# Altium schematic sheet LAUNCHXL-F28069_B_1400922_3.SchDoc: LAUNCHXL-F28069_B_1400922
size 301 x 234 mm; Origin: Eagle; Date: 2023/6/4 16:46:29; SheetNumber: 4; GateName_1: G$1; SymbolName_1: FRAME_A_L; LibraryName: frames; DeviceSetName: FRAME_A_L; GateName_2: G$2; SymbolName_2: DOCFIELD; Sheet: Sheet:; REV: REV:; COMPANY: COMPANY:; Scale:1/1: Scale: 1/1; Drawn: Drawn; Checked: Checked; Approved: Approved; Embest: Embest
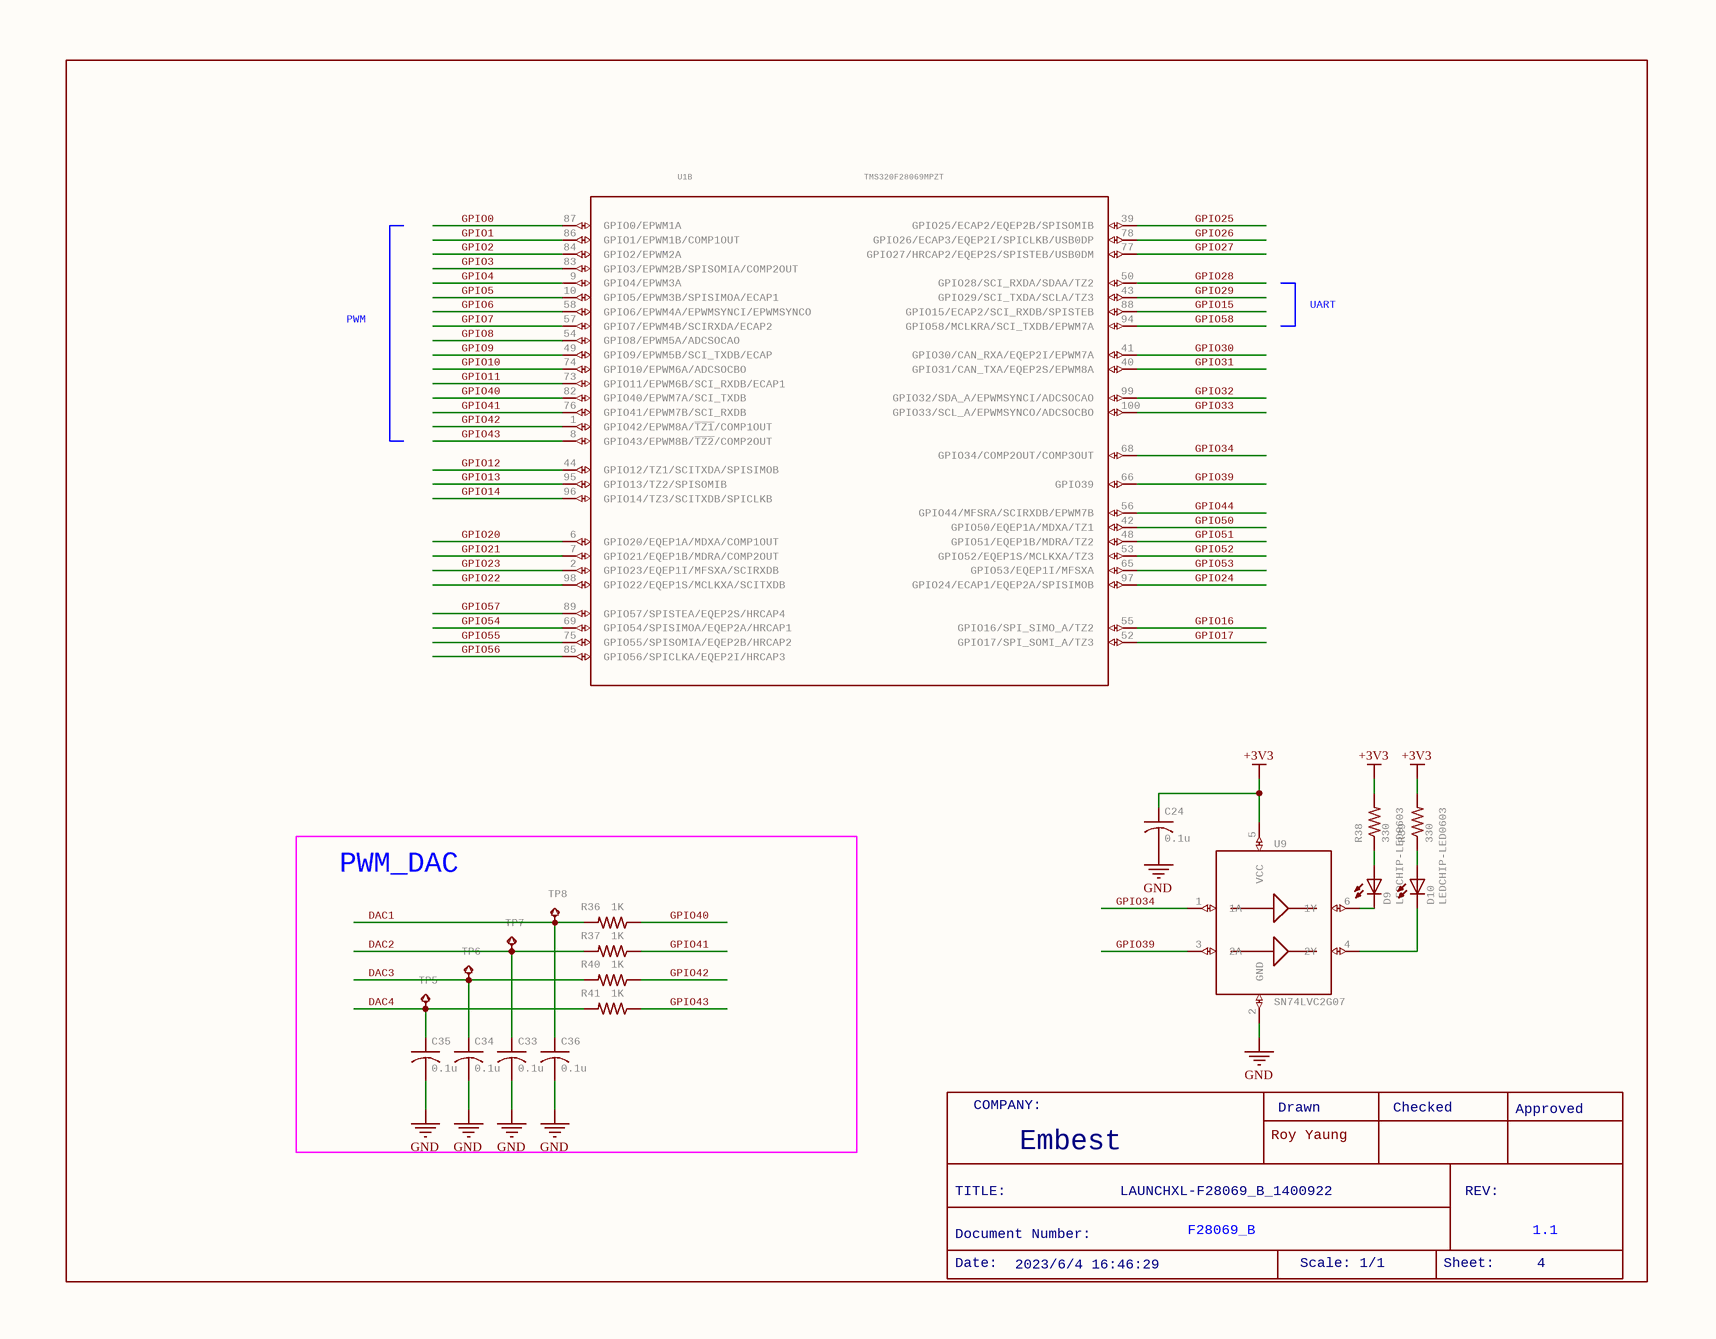
[diagram p0: LAUNCHXL-F28069_B_1400922_3.SchDoc]

## Parts
C24  0.1u  [C0402]
C33  0.1u  [C0402]
C34  0.1u  [C0402]
C35  0.1u  [C0402]
C36  0.1u  [C0402]
D9  LEDCHIP-LED0603  [CHIP-LED0603]
D10  LEDCHIP-LED0603  [CHIP-LED0603]
R36  1K  [R0402]
R37  1K  [R0402]
R38  330  [R0402]
R39  330  [R0402]
R40  1K  [R0402]
R41  1K  [R0402]
TP5  TESTPAD_TPB1,27  [TESTPAD_B1,27]  (value not drawn)
TP6  TESTPAD_TPB1,27  [TESTPAD_B1,27]  (value not drawn)
TP7  TESTPAD_TPB1,27  [TESTPAD_B1,27]  (value not drawn)
TP8  TESTPAD_TPB1,27  [TESTPAD_B1,27]  (value not drawn)
U1  TMS320F28069MPZT  [PQFP100]  (part B of 3)
U9  SN74LVC2G07  [SOT23-6-DBV]

## Blocks framed on the sheet
PWM_DAC: C33-C36 R36 R37 R40 R41 TP5-TP8

## Nets
+3V3: C24.1 R38.2 R39.2 U9.5(VCC)
GND: C24.2 C33.2 C34.2 C35.2 C36.2 U9.2(GND)
DAC1: C36.1 R36.2 TP8.TP
DAC2: C33.1 R37.2 TP7.TP
DAC3: C34.1 R40.2 TP6.TP
DAC4: C35.1 R41.2 TP5.TP
GPIO0: U1.87(GPIO0/EPWM1A)
GPIO1: U1.86(GPIO1/EPWM1B/COMP1OUT)
GPIO2: U1.84(GPIO2/EPWM2A)
GPIO3: U1.83(GPIO3/EPWM2B/SPISOMIA/COMP2OUT)
GPIO4: U1.9(GPIO4/EPWM3A)
GPIO5: U1.10(GPIO5/EPWM3B/SPISIMOA/ECAP1)
GPIO6: U1.58(GPIO6/EPWM4A/EPWMSYNCI/EPWMSYNCO)
GPIO7: U1.57(GPIO7/EPWM4B/SCIRXDA/ECAP2)
GPIO8: U1.54(GPIO8/EPWM5A/ADCSOCAO)
GPIO9: U1.49(GPIO9/EPWM5B/SCI_TXDB/ECAP)
GPIO10: U1.74(GPIO10/EPWM6A/ADCSOCBO)
GPIO11: U1.73(GPIO11/EPWM6B/SCI_RXDB/ECAP1)
GPIO12: U1.44(GPIO12/TZ1/SCITXDA/SPISIMOB)
GPIO13: U1.95(GPIO13/TZ2/SPISOMIB)
GPIO14: U1.96(GPIO14/TZ3/SCITXDB/SPICLKB)
GPIO15: U1.88(GPIO15/ECAP2/SCI_RXDB/SPISTEB)
GPIO16: U1.55(GPIO16/SPI_SIMO_A/TZ2)
GPIO17: U1.52(GPIO17/SPI_SOMI_A/TZ3)
GPIO20: U1.6(GPIO20/EQEP1A/MDXA/COMP1OUT)
GPIO21: U1.7(GPIO21/EQEP1B/MDRA/COMP2OUT)
GPIO22: U1.98(GPIO22/EQEP1S/MCLKXA/SCITXDB)
GPIO23: U1.2(GPIO23/EQEP1I/MFSXA/SCIRXDB)
GPIO24: U1.97(GPIO24/ECAP1/EQEP2A/SPISIMOB)
GPIO25: U1.39(GPIO25/ECAP2/EQEP2B/SPISOMIB)
GPIO26: U1.78(GPIO26/ECAP3/EQEP2I/SPICLKB/USB0DP)
GPIO27: U1.77(GPIO27/HRCAP2/EQEP2S/SPISTEB/USB0DM)
GPIO28: U1.50(GPIO28/SCI_RXDA/SDAA/TZ2)
GPIO29: U1.43(GPIO29/SCI_TXDA/SCLA/TZ3)
GPIO30: U1.41(GPIO30/CAN_RXA/EQEP2I/EPWM7A)
GPIO31: U1.40(GPIO31/CAN_TXA/EQEP2S/EPWM8A)
GPIO32: U1.99(GPIO32/SDA_A/EPWMSYNCI/ADCSOCAO)
GPIO33: U1.100(GPIO33/SCL_A/EPWMSYNCO/ADCSOCBO)
GPIO34: U1.68(GPIO34/COMP2OUT/COMP3OUT) U9.1(1A)
GPIO39: U1.66(GPIO39) U9.3(2A)
GPIO40: R36.1 U1.82(GPIO40/EPWM7A/SCI_TXDB)
GPIO41: R37.1 U1.76(GPIO41/EPWM7B/SCI_RXDB)
GPIO42: R40.1 U1.1(GPIO42/EPWM8A/~{TZ1}/COMP1OUT)
GPIO43: R41.1 U1.8(GPIO43/EPWM8B/~{TZ2}/COMP2OUT)
GPIO44: U1.56(GPIO44/MFSRA/SCIRXDB/EPWM7B)
GPIO50: U1.42(GPIO50/EQEP1A/MDXA/TZ1)
GPIO51: U1.48(GPIO51/EQEP1B/MDRA/TZ2)
GPIO52: U1.53(GPIO52/EQEP1S/MCLKXA/TZ3)
GPIO53: U1.65(GPIO53/EQEP1I/MFSXA)
GPIO54: U1.69(GPIO54/SPISIMOA/EQEP2A/HRCAP1)
GPIO55: U1.75(GPIO55/SPISOMIA/EQEP2B/HRCAP2)
GPIO56: U1.85(GPIO56/SPICLKA/EQEP2I/HRCAP3)
GPIO57: U1.89(GPIO57/SPISTEA/EQEP2S/HRCAP4)
GPIO58: U1.94(GPIO58/MCLKRA/SCI_TXDB/EPWM7A)
NetD9_A: D9.A R38.1
NetD9_C: D9.C U9.6(1Y)
NetD10_A: D10.A R39.1
NetD10_C: D10.C U9.4(2Y)

## Notes on the sheet
- PWM
- UART
- COMPANY:
- Roy Yaung
- Drawn
- Checked
- Approved
- TITLE:
- Embest
- LAUNCHXL-F28069_B_1400922
- REV:
- Date:
- Document Number:
- 2023/6/4 16:46:29
- F28069_B
- Scale: 1/1
- Sheet:
- 1.1
- 4

## Library data of the parts
C24 C33-C36 = C-USC0402: CAPACITOR, American symbol; GateName_1: G$1; SymbolName_1: C-US; DeviceName: C0402; LibraryName: rcl; DeviceSetName: C-US
D9 D10 = LEDCHIP-LED0603: LED   OSRAM: - CHIPLED LG R971, LG N971, LY N971, LG Q971, LY Q971, LO R971, LY R971 LH N974, LH R974 LS Q976, LO Q976, LY Q976 LO Q996 - Hyper CHIPLED LW Q18S LB Q993, LB Q99A, LB R99A - SideLED LS A670, LO A670, LY A670, LG A670, LP A670 LB A673, LV A673, LT A673, LW A673 LH A674 LY A675 LS A676, LA A676, LO A676, LY A676, LW A676 LS A679, LY A679, LG A679 -  Hyper Micro SIDELED庐 LS Y876, LA Y876, LO Y876, LY Y876 LT Y87S - SmartLED LW L88C, LW L88S LB L89C, LB L89S, LG L890 LS L89K, LO L89K, LY L89K LS L896, LA L896, LO L896, LY L896 - TOPLED LS T670, LO T670, LY T670, LG T670, LP T670 LSG T670, LSP T670, LSY T670, LOP T670, LYG T670 LG T671, LOG T671, LSG T671 LB T673, LV T673, LT T673, LW T673 LH T674 LS T676, LA T676, LO T676, LY T676, LB T676, LH T676, LSB T676, LW T676 LB T67C, LV T67C, LT T67C, LS T67K, LO T67K, LY T67K, LW E67C LS E67B, LA E67B, LO E67B, LY E67B, LB E67C, LV E67C, LT E67C LW T67C LS T679, LY T679, LG T679 LS T770, LO T770, LY T770, LG T770, LP T770 LB T773, LV T773, LT T773, LW T773 LH T774 LS E675, LA E675, LY E675, LS T675 LS T776, LA T776, LO T776, LY T776, LB T776 LHGB T686 LT T68C, LB T68C - Hyper Mini TOPLED庐 LB M676 - Mini TOPLED Santana庐 LG M470 LS M47K, LO M47K, LY M47K    Source: http://www.osram.convergy.de   LUXEON: - LUMILED庐 LXK2-PW12-R00, LXK2-PW12-S00, LXK2-PW14-U00, LXK2-PW14-V00 LXK2-PM12-R00, LXK2-PM12-S00, LXK2-PM14-U00 LXK2-PE12-Q00, LXK2-PE12-R00, LXK2-PE12-S00, LXK2-PE14-T00, LXK2-PE14-U00 LXK2-PB12-K00, LXK2-PB12-L00, LXK2-PB12-M00, LXK2-PB14-N00, LXK2-PB14-P00, LXK2-PB14-Q00 LXK2-PR12-L00, LXK2-PR12-M00, LXK2-PR14-Q00, LXK2-PR14-R00 LXK2-PD12-Q00, LXK2-PD12-R00, LXK2-PD12-S00 LXK2-PH12-R00, LXK2-PH12-S00 LXK2-PL12-P00, LXK2-PL12-Q00, LXK2-PL12-R00    Source: www.luxeon.com   KINGBRIGHT:   KA-3528ASYC Source: www.kingbright.com; GateName_1: G$1; SymbolName_1: LED; DeviceName: CHIP-LED0603; LibraryName: led; DeviceSetName: LED
R36-R41 = R-US_R0402: RESISTOR, American symbol; GateName_1: G$1; SymbolName_1: R-US; DeviceSetName: R-US_; DeviceName: R0402; LibraryName: rcl
TP5-TP8 = TESTPAD_TPB1,27: Test pad; GateName_1: G$1; DeviceName: B1,27; SymbolName_1: TESTPAD_TP; LibraryName: RF430FRL152H_EVM_a; DeviceSetName: TESTPAD_TP
U1 = TMS320F28069PZSR: GateName_1: G$1; SymbolName_1: TI_TMSF2806X_FUN; GateName_2: G$2; SymbolName_2: TI_TMSF2806X_IO; GateName_3: G$3; SymbolName_3: TI_TMSF2806X_PW; DeviceName: R; LibraryName: LAUNCHXL-F28027; DeviceSetName: TMS320F28069PZS
U9 = SN74LVC2G07: GateName_1: G$1; SymbolName_1: SN74LVC2G07; LibraryName: texas; DeviceSetName: SN74LVC2G07